# EAGLE design fretscanner-INPUTS (EAGLE 6.6.0)
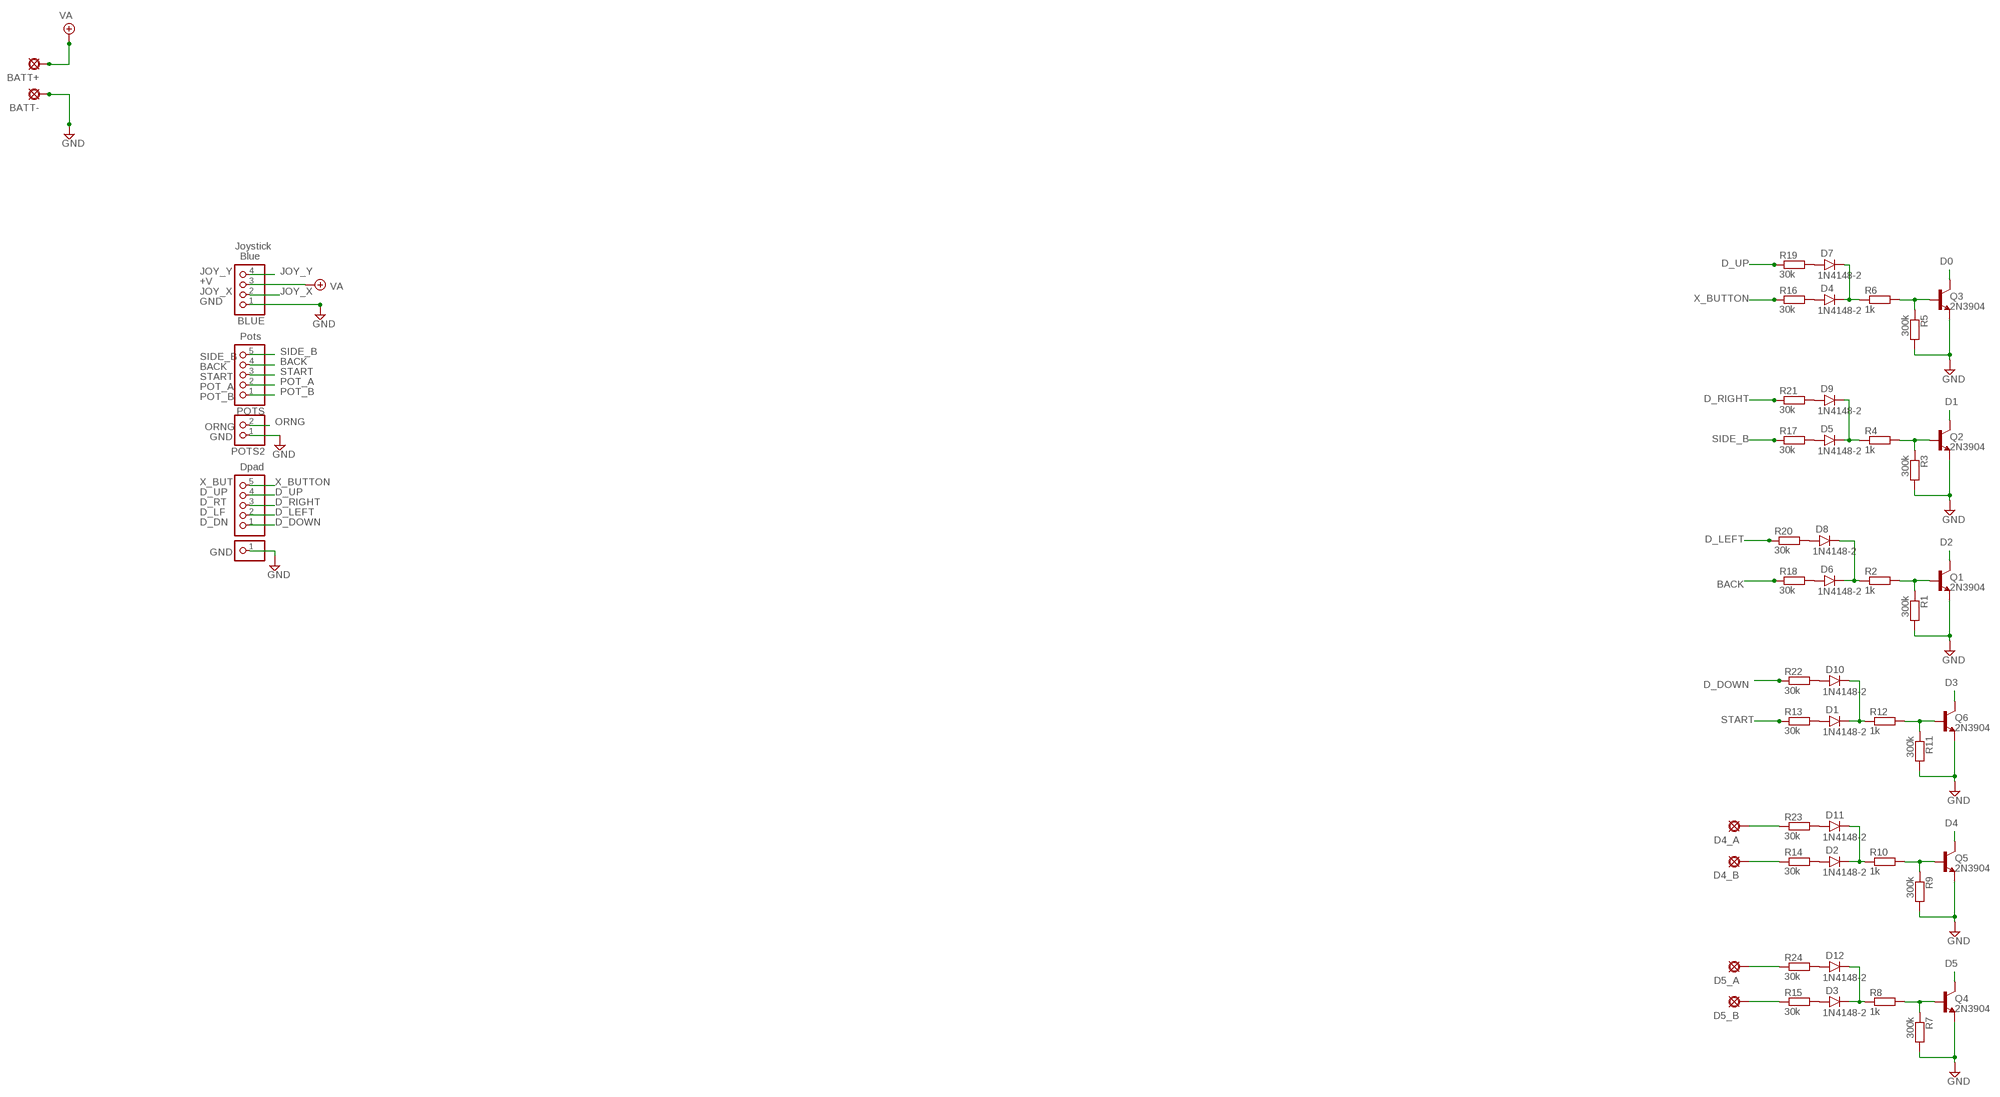
[diagram p0: schematic, sheet 1]

## Parts
BATT+  PADL  [LONG]
BATT-  PADL  [LONG]
BLUE  PINHD-1X4  [1X04]
D1  1N4148-2  [DO35-2]
D2  1N4148-2  [DO35-2]
D3  1N4148-2  [DO35-2]
D4  1N4148-2  [DO35-2]
D4_A  PAD  [SQUARE]
D4_B  PAD  [SQUARE]
D5  1N4148-2  [DO35-2]
D5_A  PAD  [SQUARE]
D5_B  PAD  [SQUARE]
D6  1N4148-2  [DO35-2]
D7  1N4148-2  [DO35-2]
D8  1N4148-2  [DO35-2]
D9  1N4148-2  [DO35-2]
D10  1N4148-2  [DO35-2]
D11  1N4148-2  [DO35-2]
D12  1N4148-2  [DO35-2]
DPAD  PINHD-1X5  [1X05]
DPAD2  PINHD-1X1  [1X01]
POTS  PINHD-1X5  [1X05]
POTS2  PINHD-1X2  [1X02]
Q1  2N3904  [TO92-]
Q2  2N3904  [TO92-]
Q3  2N3904  [TO92-]
Q4  2N3904  [TO92-]
Q5  2N3904  [TO92-]
Q6  2N3904  [TO92-]
R1  300k  6MM-EU1  [R0207/1V]
R2  1k  6MM-EU1  [R0207/1V]
R3  300k  6MM-EU1  [R0207/1V]
R4  1k  6MM-EU1  [R0207/1V]
R5  300k  6MM-EU1  [R0207/1V]
R6  1k  6MM-EU1  [R0207/1V]
R7  300k  6MM-EU1  [R0207/1V]
R8  1k  6MM-EU1  [R0207/1V]
R9  300k  6MM-EU1  [R0207/1V]
R10  1k  6MM-EU1  [R0207/1V]
R11  300k  6MM-EU1  [R0207/1V]
R12  1k  6MM-EU1  [R0207/1V]
R13  30k  6MM-EU  [R0207/3]
R14  30k  6MM-EU  [R0207/3]
R15  30k  6MM-EU  [R0207/3]
R16  30k  6MM-EU  [R0207/3]
R17  30k  6MM-EU  [R0207/3]
R18  30k  6MM-EU  [R0207/3]
R19  30k  6MM-EU  [R0207/3]
R20  30k  6MM-EU  [R0207/3]
R21  30k  6MM-EU  [R0207/3]
R22  30k  6MM-EU  [R0207/3]
R23  30k  6MM-EU  [R0207/3]
R24  30k  6MM-EU  [R0207/3]

## Nets
BACK: POTS.4 R18.1
D0: Q3.1(C)
D1: Q2.1(C)
D2: Q1.1(C)
D3: Q6.1(C)
D4: Q5.1(C)
D5: Q4.1(C)
D_DOWN: DPAD.1 R22.1
D_LEFT: DPAD.2 R20.1
D_RIGHT: DPAD.3 R21.1
D_UP: DPAD.4 R19.1
GND: BATT-.1(PAD) BLUE.1 DPAD2.1 POTS2.1 Q1.3(E) Q2.3(E) Q3.3(E) Q4.3(E) Q5.3(E) Q6.3(E) R1.2 R3.2 R5.2 R7.2 R9.2 R11.2
JOY_X: BLUE.2
JOY_Y: BLUE.4
N$2: Q2.2(B) R3.1 R4.2
N$3: D3.A R15.2
N$4: D5.C D9.C R4.1
N$5: Q3.2(B) R5.1 R6.2
N$6: Q1.2(B) R1.1 R2.2
N$7: D6.C D8.C R2.1
N$8: D4.A R16.2
N$9: D5.A R17.2
N$10: D4.C D7.C R6.1
N$11: Q4.2(B) R7.1 R8.2
N$12: D6.A R18.2
N$13: D3.C D12.C R8.1
N$14: Q5.2(B) R9.1 R10.2
N$15: D1.A R13.2
N$17: D2.C D11.C R10.1
N$18: Q6.2(B) R11.1 R12.2
N$19: D2.A R14.2
N$20: D1.C D10.C R12.1
N$21: D7.A R19.2
N$22: D8.A R20.2
N$23: D9.A R21.2
N$24: D10.A R22.2
N$25: D4_B.1(PAD) R14.1
N$26: D5_B.1(PAD) R15.1
N$27: D11.A R23.2
N$29: D12.A R24.2
N$30: D4_A.1(PAD) R23.1
N$31: D5_A.1(PAD) R24.1
ORNG: POTS2.2
POT_A: POTS.2
POT_B: POTS.1
SIDE_B: POTS.5 R17.1
START: POTS.3 R13.1
VA: BATT+.1(PAD) BLUE.3
X_BUTTON: DPAD.5 R16.1

## Notes on the sheet
- Joystick
- Blue
- JOY_Y
- +V
- JOY_X
- GND
- Pots
- SIDE_B
- BACK
- START
- POT_A
- POT_B
- ORNG
- GND
- Dpad
- X_BUT
- D_UP
- D_RT
- D_LF
- D_DN
- GND

## Library data of the parts
BATT+ BATT- D4_A D4_B D5_A D5_B = gm-supply:PAD: PAD use this package for pads with any purpose, including input, output, send or return various pad shapes: round, square, octogonal, long, and long offset
BLUE = pinhead:PINHD-1X4: PIN HEADER
D1-D12 = gm-diodes:1N4148: Fast Switching Diode DO-35 glass case a.k.a. 1N914
DPAD POTS = pinhead:PINHD-1X5: PIN HEADER
DPAD2 = pinhead:PINHD-1X1: PIN HEADER
POTS2 = pinhead:PINHD-1X2: PIN HEADER
Q1-Q6 = gm-trans:2N3904: NPN Transistor
R1-R24 = gm-resistors:6MM-EU: 6mm Resistors (European schematic symbol) Leads spaced 1-6 holes apart for 0.1" perfboard. Suitable for 1/4 watt resistors.

## Board
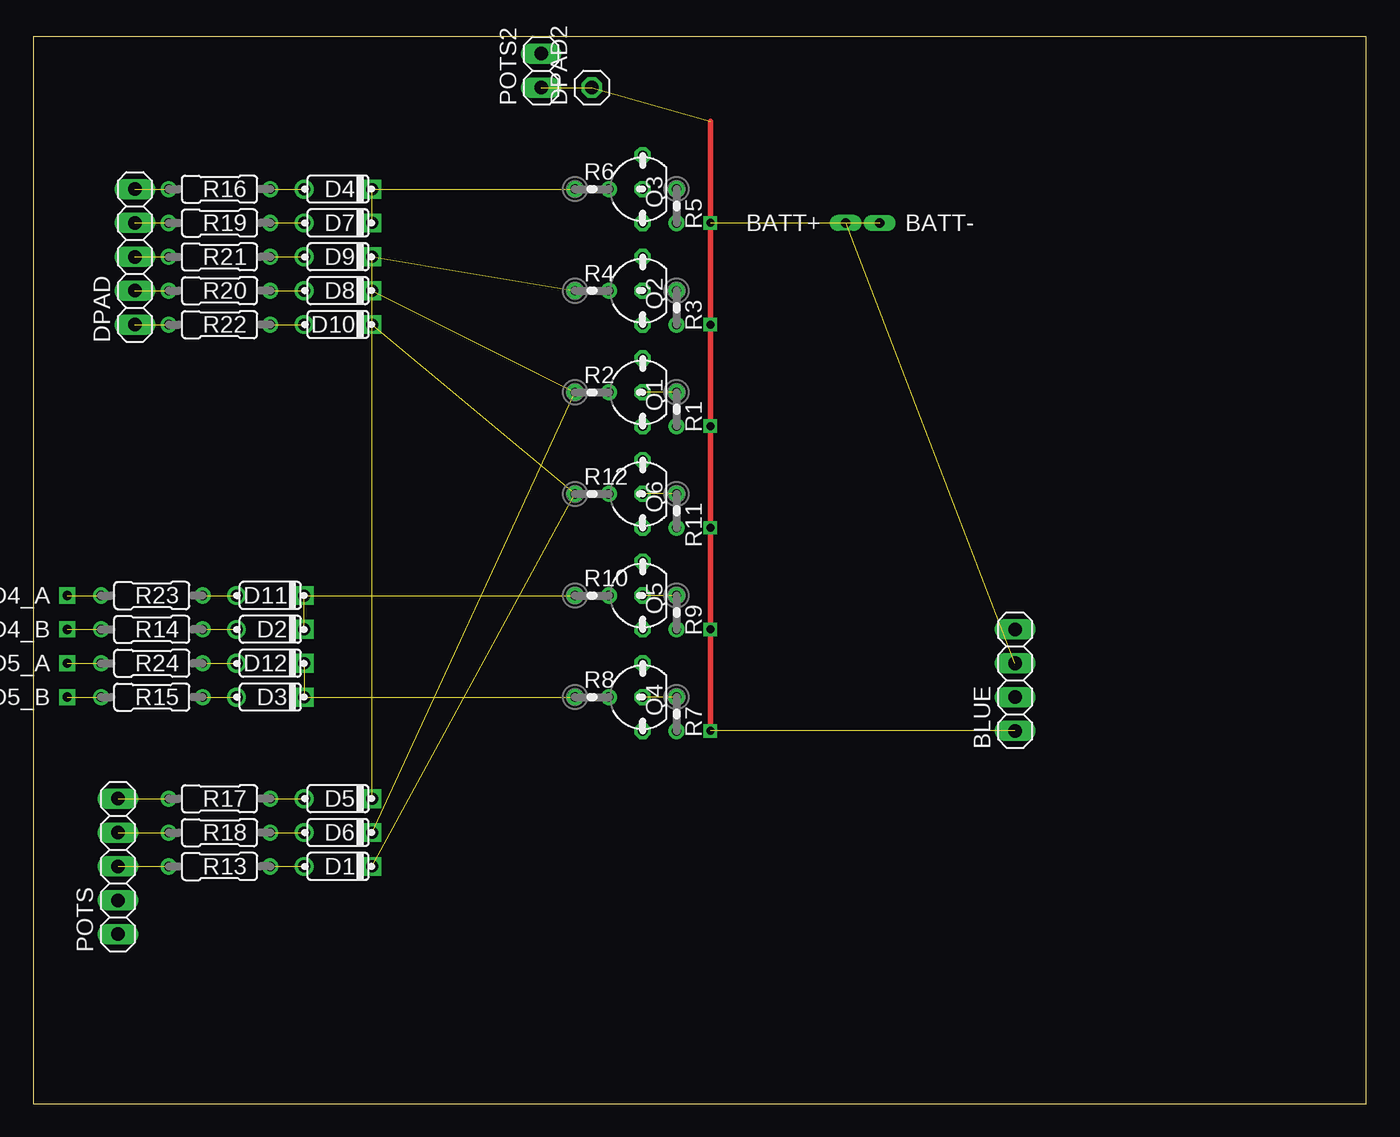
[diagram p1: board, top side]
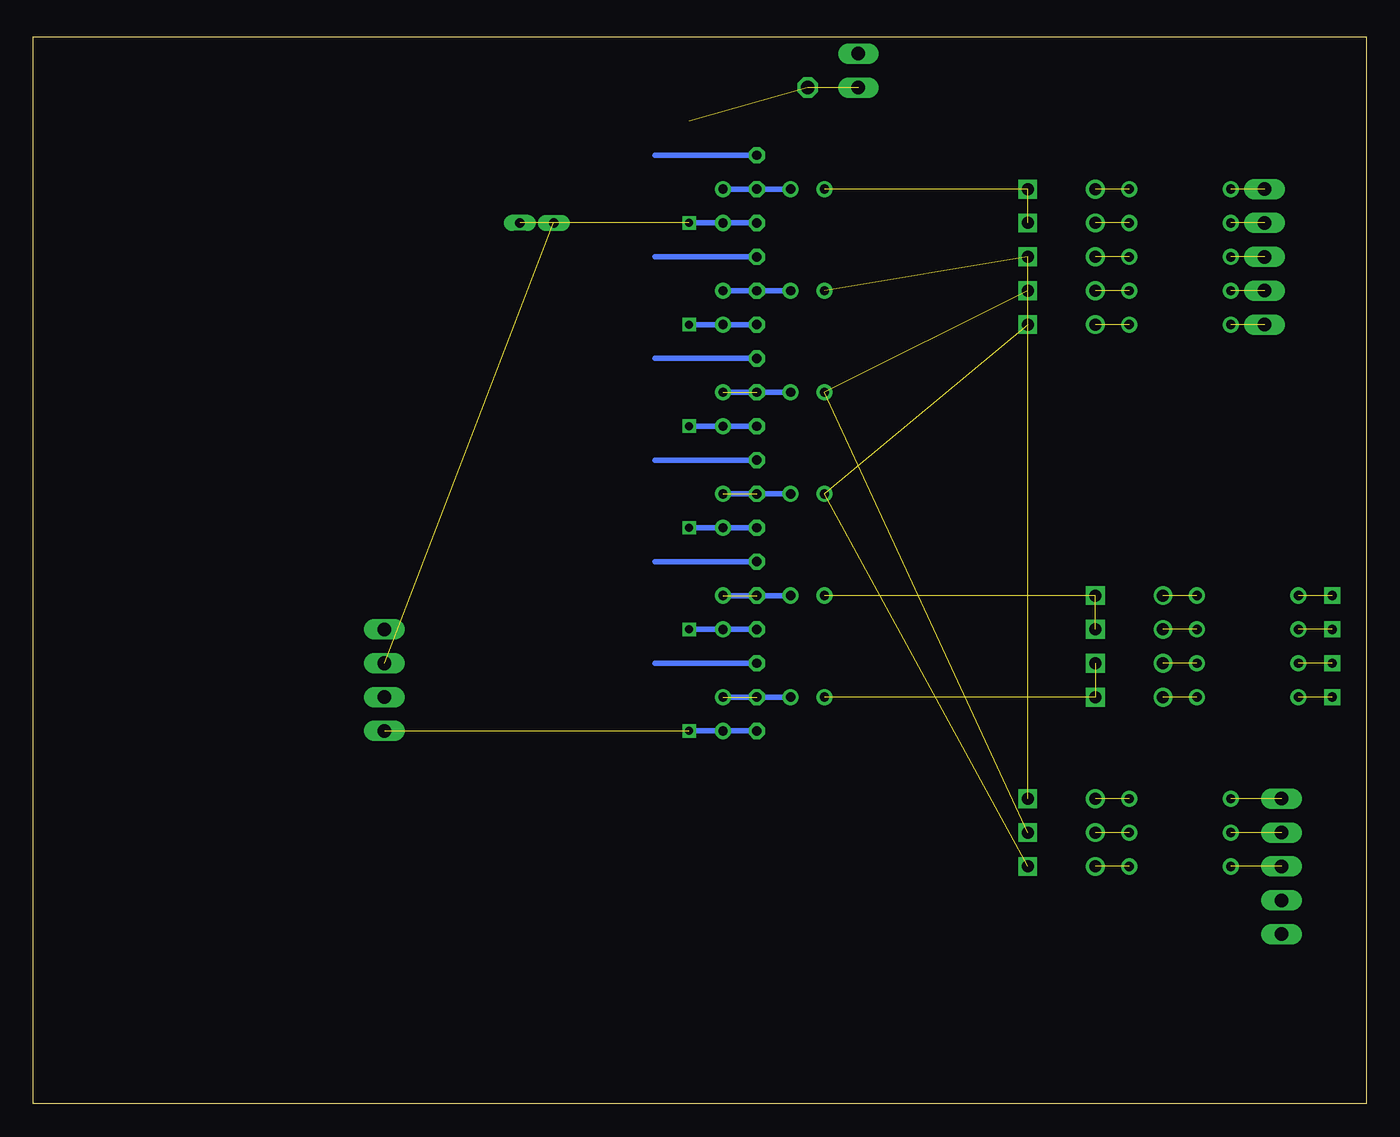
[diagram p2: board, bottom side, seen from below]

Size 100 x 80 mm. Coordinates in mm from the lower left corner, seen from the top.
Outline: 0,0 100,0 100,80 0,80 0,0
Copper layers (1*16): Top 0.035mm / dielectric 1.5mm / Bottom 0.035mm
Design rules "default": minimum track width 10mil, minimum drill 24mil, track to track 8mil, track to pad 8mil, pad to pad 8mil, via to via 8mil, smd to smd 8mil, copper to edge 40mil, drill to drill 8mil, minimum pad ring 10mil, minimum via ring 8mil, stop-mask expansion 4mil, vias tented up to drill 0mil, thermal gap 10mil

### Footprints (pad centres in the part's own frame; a part is rotated, then mirrored left to right if it is on the bottom)
LONG = drill 0.7 long: 1 0,0
1X04 = drill 1.016 long: 1 -3.81,0; 2 -1.27,0; 3 1.27,0; 4 3.81,0
DO35-2 = drill 0.9: A 2.54,0 | drill 0.9 square: C -2.54,0
SQUARE = drill 0.7 square: 1 0,0
1X05 = drill 1.016 long: 1 -5.08,0; 2 -2.54,0; 3 0,0; 4 2.54,0; 5 5.08,0
1X01 = drill 1.016 octagon: 1 0,0
1X02 = drill 1.016 long: 1 -1.27,0; 2 1.27,0
TO92- = drill 0.7 octagon: 1 2.54,0; 2 0,0; 3 -2.54,0
R0207/1V = drill 0.7: 1 -1.27,0; 2 1.27,0
R0207/3 = drill 0.7: 1 -3.81,0; 2 3.81,0

### Placement (x,y rotation side)
BATT+  60.96,66.04 180 top
BATT-  63.5,66.04 0 top
BLUE  73.66,31.75 90 top
D1  22.86,17.78 180 top
D2  17.78,35.56 180 top
D3  17.78,30.48 180 top
D4  22.86,68.58 180 top
D4_A  2.54,38.1 180 top
D4_B  2.54,35.56 180 top
D5  22.86,22.86 180 top
D5_A  2.54,33.02 180 top
D5_B  2.54,30.48 180 top
D6  22.86,20.32 180 top
D7  22.86,66.04 180 top
D8  22.86,60.96 180 top
D9  22.86,63.5 180 top
D10  22.86,58.42 180 top
D11  17.78,38.1 180 top
D12  17.78,33.02 180 top
DPAD  7.62,63.5 90 top
DPAD2  41.91,76.2 90 top
POTS  6.35,17.78 90 top
POTS2  38.1,77.47 90 top
Q1  45.72,53.34 90 top
Q2  45.72,60.96 90 top
Q3  45.72,68.58 90 top
Q4  45.72,30.48 90 top
Q5  45.72,38.1 90 top
Q6  45.72,45.72 90 top
R1  48.26,52.07 270 top
R2  41.91,53.34 0 top
R3  48.26,59.69 270 top
R4  41.91,60.96 0 top
R5  48.26,67.31 270 top
R6  41.91,68.58 0 top
R7  48.26,29.21 270 top
R8  41.91,30.48 0 top
R9  48.26,36.83 270 top
R10  41.91,38.1 0 top
R11  48.26,44.45 270 top
R12  41.91,45.72 0 top
R13  13.97,17.78 0 top
R14  8.89,35.56 0 top
R15  8.89,30.48 0 top
R16  13.97,68.58 0 top
R17  13.97,22.86 0 top
R18  13.97,20.32 0 top
R19  13.97,66.04 0 top
R20  13.97,60.96 0 top
R21  13.97,63.5 0 top
R22  13.97,58.42 0 top
R23  8.89,38.1 0 top
R24  8.89,33.02 0 top

### Tracks (layer width: path | path; a pad name or v marks a point on that pad's centre or on a via)
BACK  (1 unrouted)
D0
  Bottom 0.406: Q3.1 53.34,71.12
D1
  Bottom 0.406: Q2.1 53.34,63.5
D2
  Bottom 0.406: Q1.1 53.34,55.88
D3
  Bottom 0.406: Q6.1 53.34,48.26
D4
  Bottom 0.406: Q5.1 53.34,40.64
D5
  Bottom 0.406: Q4.1 53.34,33.02
D_DOWN  (1 unrouted)
D_LEFT  (1 unrouted)
D_RIGHT  (1 unrouted)
D_UP  (1 unrouted)
GND  (via drill 0.6)  (4 unrouted)
  Top 0.406: v50.8,27.94 v50.8,35.56 v50.8,43.18 v50.8,50.8 v50.8,58.42 v50.8,66.04 50.8,73.66
  Bottom 0.406: Q4.3 R7.2 v50.8,27.94 | Q5.3 R9.2 v50.8,35.56 | Q6.3 R11.2 v50.8,43.18 | Q3.3 R5.2 v50.8,66.04 | Q1.3 R1.2 v50.8,50.8 | Q2.3 R3.2 v50.8,58.42
N$2
  Bottom 0.406: R4.2 Q2.2 R3.1
N$3  (1 unrouted)
N$4  (2 unrouted)
N$5
  Bottom 0.406: R6.2 Q3.2 R5.1
N$6  (1 unrouted)
  Bottom 0.406: R2.2 R1.1
N$7  (2 unrouted)
N$8  (1 unrouted)
N$9  (1 unrouted)
N$10  (2 unrouted)
N$11  (1 unrouted)
  Bottom 0.406: R8.2 R7.1
N$12  (1 unrouted)
N$13  (2 unrouted)
N$14  (1 unrouted)
  Bottom 0.406: R10.2 R9.1
N$15  (1 unrouted)
N$17  (2 unrouted)
N$18  (1 unrouted)
  Bottom 0.406: R12.2 R11.1
N$19  (1 unrouted)
N$20  (2 unrouted)
N$21  (1 unrouted)
N$22  (1 unrouted)
N$23  (1 unrouted)
N$24  (1 unrouted)
N$25  (1 unrouted)
N$26  (1 unrouted)
N$27  (1 unrouted)
N$29  (1 unrouted)
N$30  (1 unrouted)
N$31  (1 unrouted)
SIDE_B  (1 unrouted)
START  (1 unrouted)
VA  (1 unrouted)
X_BUTTON  (1 unrouted)